# EAGLE design preamp (EAGLE 7.5.0)
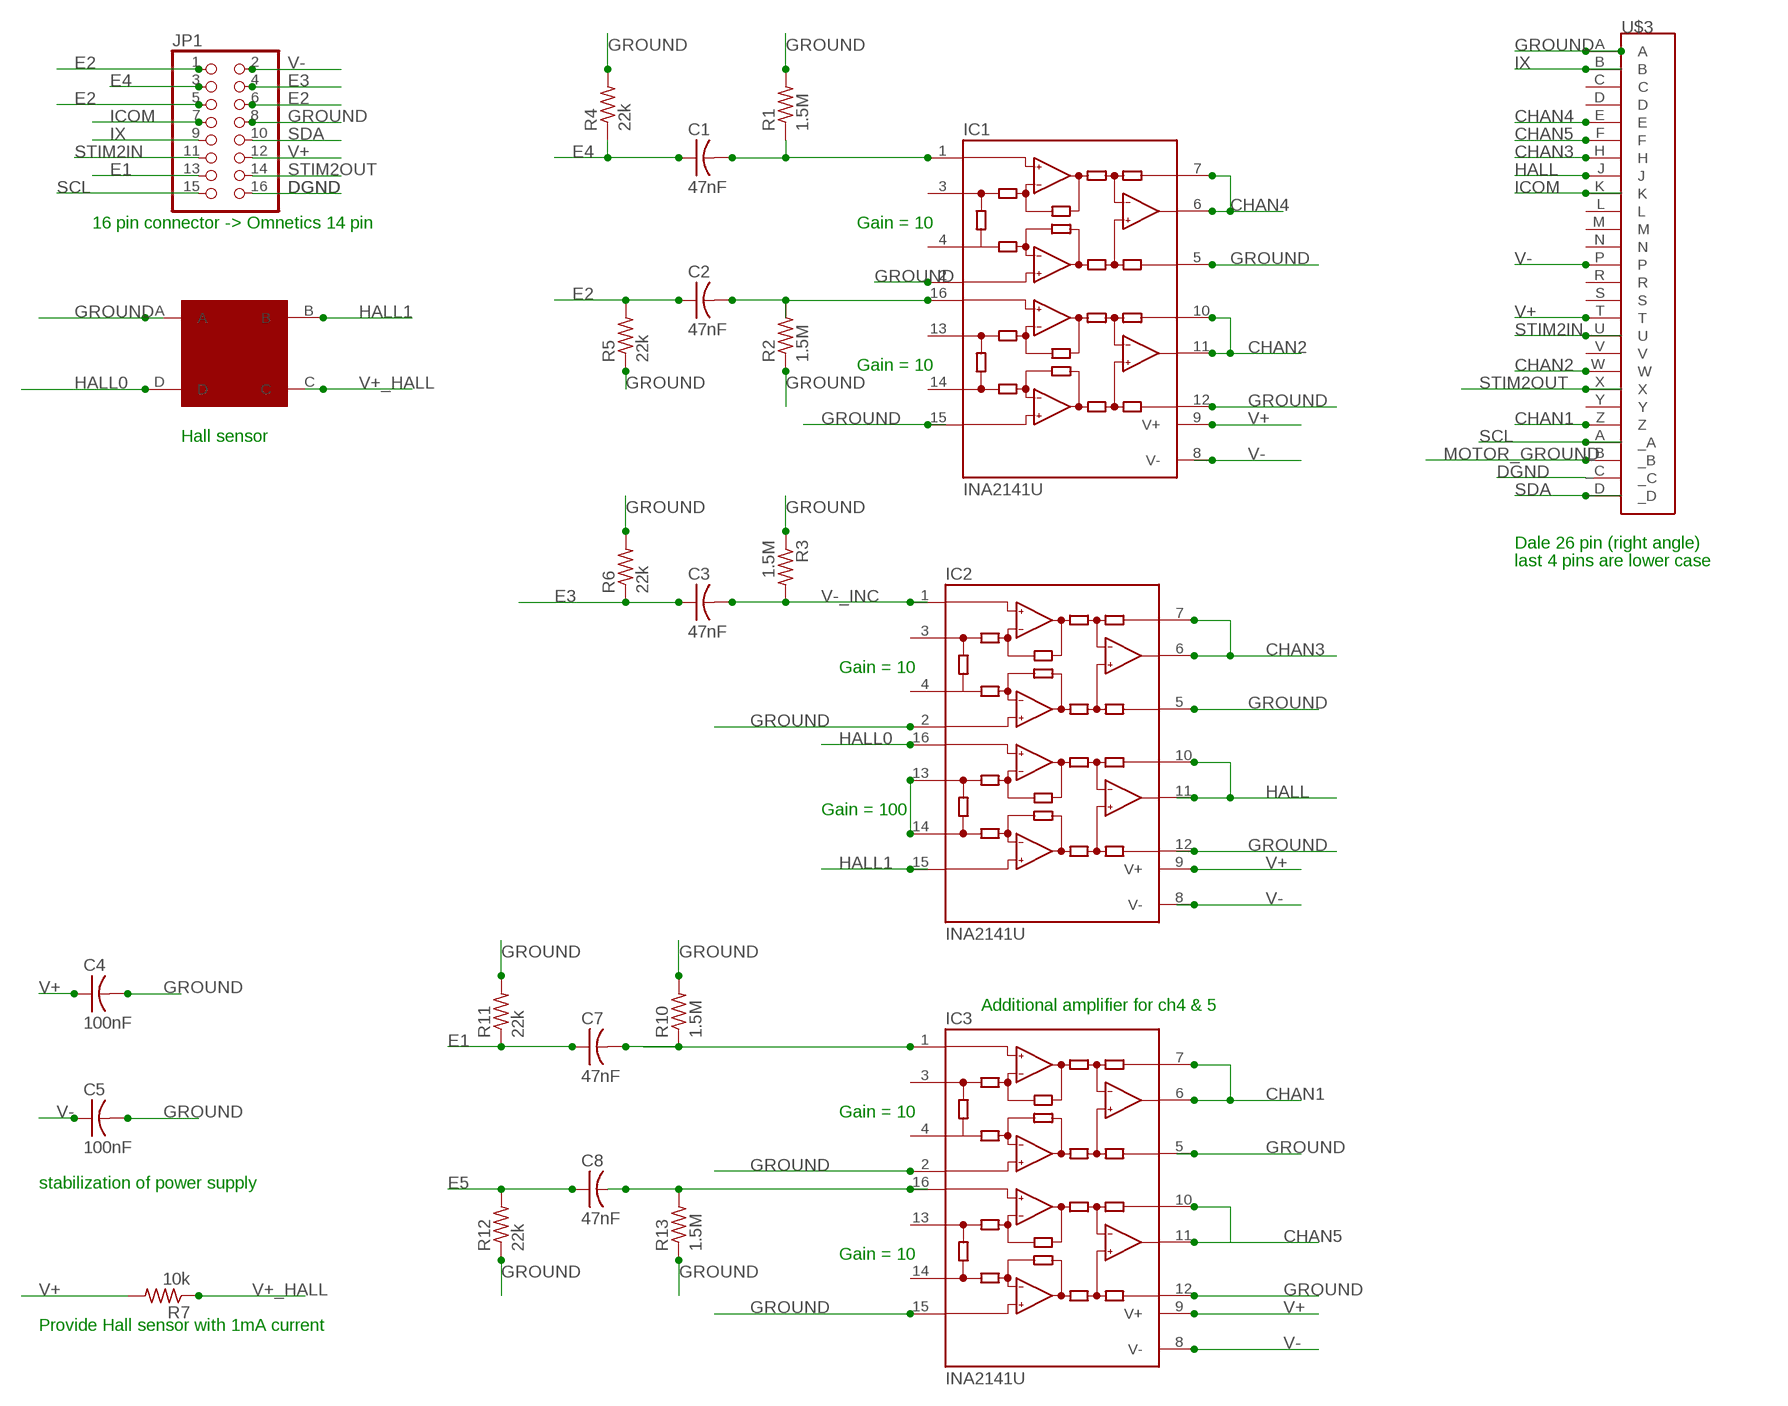
[diagram p0: schematic, sheet 1]

## Parts
C1  47nF  C0805ELM  [R0805ELM]
C2  47nF  C0805ELM  [R0805ELM]
C3  47nF  C0805ELM  [R0805ELM]
C4  100nF  C0805ELM  [R0805ELM]
C5  100nF  C0805ELM  [R0805ELM]
C7  47nF  C0805ELM  [R0805ELM]
C8  47nF  C0805ELM  [R0805ELM]
IC1  INA2141U  [SO16-1]
IC2  INA2141U  [SO16-1]
IC3  INA2141U  [SO16-1]
JP1  PINHD-2X8  [2X08]
R1  1.5M  R0805ELM  [R0805ELM]
R2  1.5M  R0805ELM  [R0805ELM]
R3  1.5M  R0805ELM  [R0805ELM]
R4  22k  R0805ELM  [R0805ELM]
R5  22k  R0805ELM  [R0805ELM]
R6  22k  R0805ELM  [R0805ELM]
R7  10k  R0805ELM  [R0805ELM]
R10  1.5M  R0805ELM  [R0805ELM]
R11  22k  R0805ELM  [R0805ELM]
R12  22k  R0805ELM  [R0805ELM]
R13  1.5M  R0805ELM  [R0805ELM]
U$2  HALL  HALL_ON_SIDE  [HALL_ON_SIDE]
U$3  MMD1P22G-26-M101  [MMD1P22G-26-M101]

## Nets
CHAN1: IC3.6(VOA) IC3.7(SENSEA) U$3.Z
CHAN2: IC1.10(SENSEB) IC1.11(VOB) U$3.W
CHAN3: IC2.6(VOA) IC2.7(SENSEA) U$3.H
CHAN4: IC1.6(VOA) IC1.7(SENSEA) U$3.E
CHAN5: IC3.10(SENSEB) IC3.11(VOB) U$3.F
DGND: JP1.16 U$3._C
E1: C7.1 JP1.13 R11.1
E2: C2.1 JP1.1 JP1.5 JP1.6 R5.2
E3: C3.1 JP1.4 R6.1
E4: C1.1 JP1.3 R4.1
E5: C8.1 R12.2
GAIN_HALL: IC2.13(JB) IC2.14(JB)
GROUND: C4.2 C5.2 IC1.2(INA+) IC1.5(REFA) IC1.12(REFB) IC1.15(INB+) IC2.2(INA+) IC2.5(REFA) IC2.12(REFB) IC3.2(INA+) IC3.5(REFA) IC3.12(REFB) IC3.15(INB+) JP1.8 R1.2 R2.1 R3.1 R4.2 R5.1 R6.2 R10.2 R11.2 R12.1 R13.1 U$2.A U$3.A
HALL: IC2.10(SENSEB) IC2.11(VOB) U$3.J
HALL0: IC2.16(INB-) U$2.D
HALL1: IC2.15(INB+) U$2.B
ICOM: JP1.7 U$3.K
IX: JP1.9 U$3.B
MOTOR_GROUND: U$3._B
N$3: C2.2 IC1.16(INB-) R2.2
N$7: C8.2 IC3.16(INB-) R13.2
N$8: C7.2 IC3.1(INA-) R10.1
SCL: JP1.15 U$3._A
SDA: JP1.10 U$3._D
STIM2IN: JP1.11 U$3.U
STIM2OUT: JP1.14 U$3.X
V+: C4.1 IC1.9(V+) IC2.9(V+) IC3.9(V+) JP1.12 R7.2 U$3.T
V+_HALL: R7.1 U$2.C
V-: C5.1 IC1.8(V-) IC2.8(V-) IC3.8(V-) JP1.2 U$3.P
V-_INA: C1.2 IC1.1(INA-) R1.1
V-_INC: C3.2 IC2.1(INA-) R3.2
Unconnected: IC1.3(JA) IC1.4(JA) IC1.13(JB) IC1.14(JB) IC2.3(JA) IC2.4(JA) IC3.3(JA) IC3.4(JA) IC3.13(JB) IC3.14(JB) U$3.C U$3.D U$3.L U$3.M U$3.N U$3.R U$3.S U$3.V U$3.Y

## Notes on the sheet
- 16 pin connector -> Omnetics 14 pin | Gain = 10
- Gain = 10
- Hall sensor
- Dale 26 pin (right angle)
- last 4 pins are lower case
- Gain = 10
- Gain = 100
- Additional amplifier for ch4 & 5
- Gain = 10
- stabilization of power supply
- Gain = 10
- Provide Hall sensor with 1mA current

## Library data of the parts
C1-C5 C7 C8 = elm:C0805ELM
IC1-IC3 = burr-brown:INA2141: Instrumentation Amplifier Dual, Low Power, G = 10, 100; MF: TEXAS INSTRUMENT CONNECTORS; MPN: INA2141U; OC_FARNELL: 1459468; OC_NEWARK: 74C9853
JP1 = pinhead:PINHD-2X8: PIN HEADER
R1-R7 R10-R13 = elm:R0805ELM
U$2 = elm:HALL_ON_SIDE
U$3 = elm:MMD1P22G-26-M101

## Board
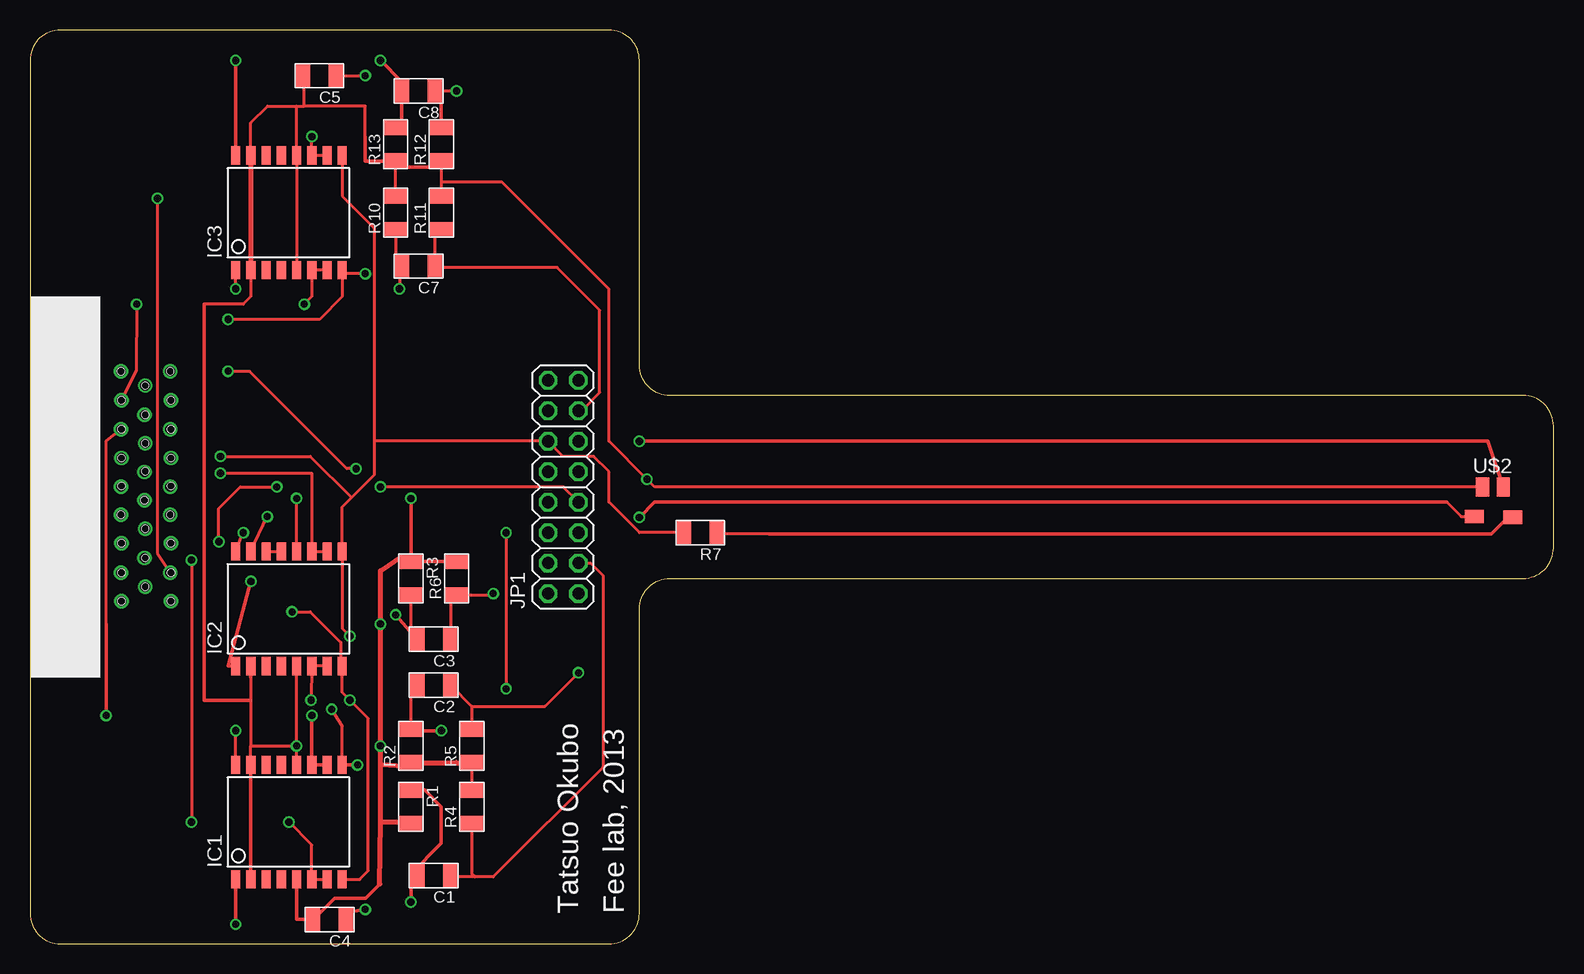
[diagram p1: board, top side]
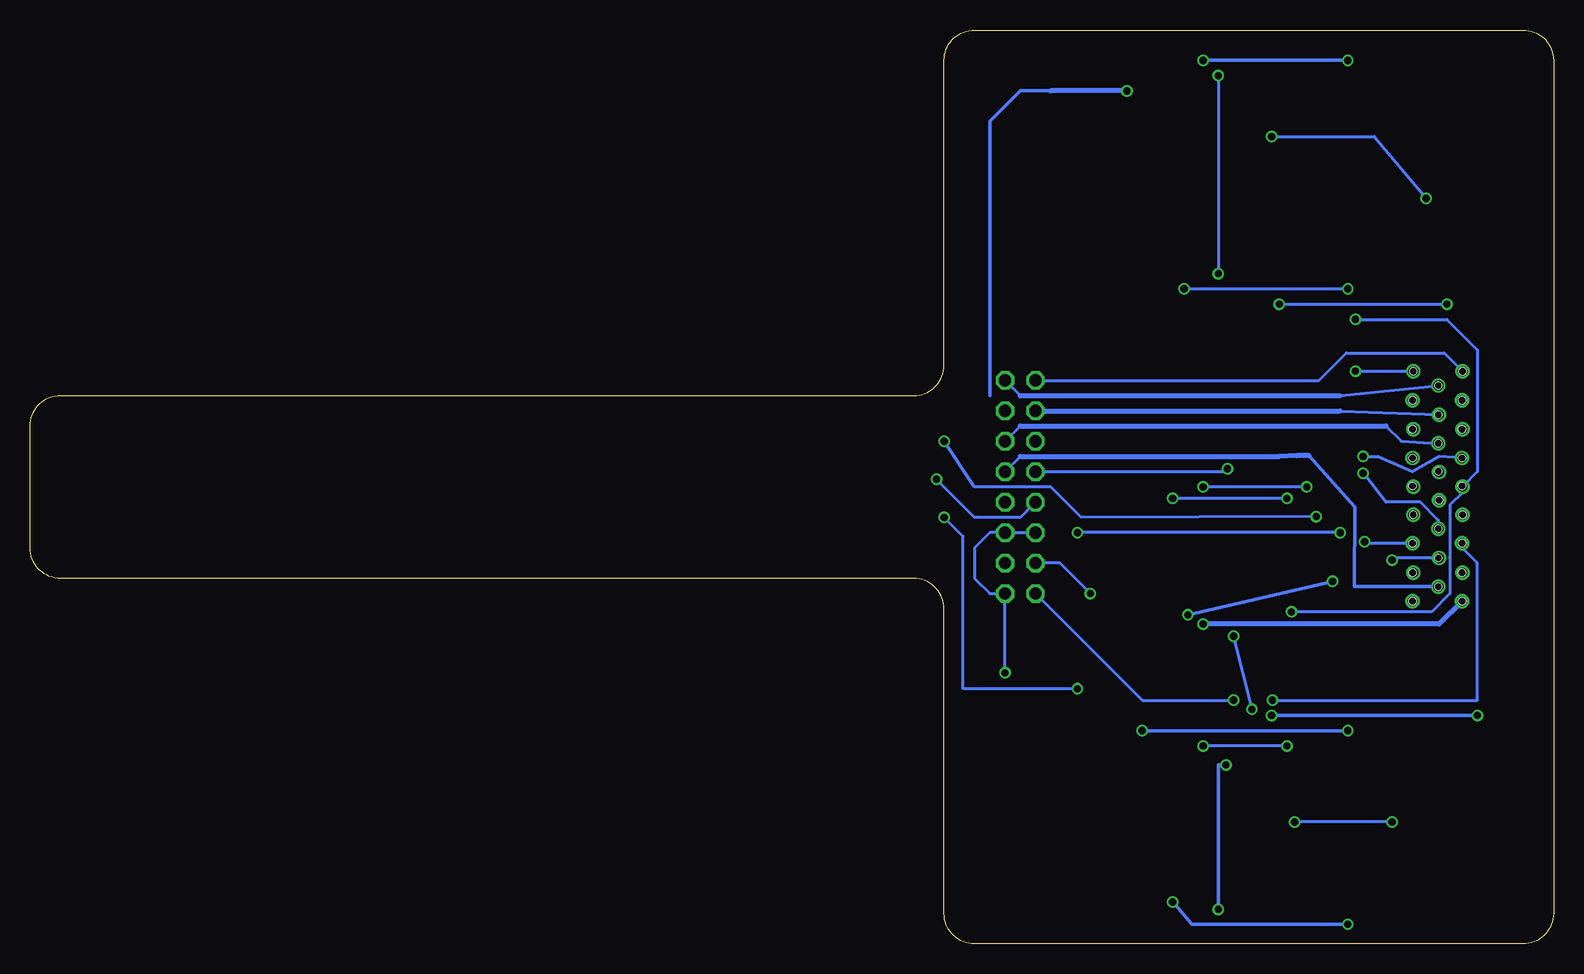
[diagram p2: board, bottom side, seen from below]

Size 127 x 76.2 mm. Coordinates in mm from the lower left corner, seen from the top.
Outline: 0,2.54 arc90 2.54,0 48.26,0 arc90 50.8,2.54 50.8,27.94 arc-90 53.34,30.48 124.46,30.48 arc90 127,33.02 127,43.18 arc90 124.46,45.72 53.34,45.72 arc-90 50.8,48.26 50.8,73.66 arc90 48.26,76.2 2.54,76.2 arc90 0,73.66 0,2.54
Copper layers (1*16): Top 0.0356mm / dielectric 1.5011mm / Bottom 0.0356mm
Design rules "oshpark-2layer": minimum track width 6mil, minimum drill 13mil, track to track 6mil, track to pad 6mil, pad to pad 6mil, via to via 6mil, smd to smd 6mil, copper to edge 15mil, drill to drill 6mil, minimum pad ring 7mil, minimum via ring 7mil, stop-mask expansion 2.5mil, vias tented up to drill 0mil, thermal gap 10mil

### Footprints (pad centres in the part's own frame; a part is rotated, then mirrored left to right if it is on the bottom)
R0805ELM = smd 1.27 x 1.905: 1 -1.397,0; 2 1.397,0
SO16-1 = smd 0.762 x 1.524: 1 -4.445,-4.775; 2 -3.175,-4.775; 3 -1.905,-4.775; 4 -0.635,-4.775; 5 0.635,-4.775; 6 1.905,-4.775; 7 3.175,-4.775; 8 4.445,-4.775; 9 4.445,4.775; 10 3.175,4.775; 11 1.905,4.775; 12 0.635,4.775; 13 -0.635,4.775; 14 -1.905,4.775; 15 -3.175,4.775; 16 -4.445,4.775
2X08 = drill 1.016 octagon: 1 -8.89,-1.27; 2 -8.89,1.27; 3 -6.35,-1.27; 4 -6.35,1.27; 5 -3.81,-1.27; 6 -3.81,1.27; 7 -1.27,-1.27; 8 -1.27,1.27; 9 1.27,-1.27; 10 1.27,1.27; 11 3.81,-1.27; 12 3.81,1.27; 13 6.35,-1.27; 14 6.35,1.27; 15 8.89,-1.27; 16 8.89,1.27
HALL_ON_SIDE = smd 1.118 x 1.6: A -0.838,0; B 0.889,0 | smd 1.6 x 1.118: C 1.676,-2.515; D -1.524,-2.464
MMD1P22G-26-M101 = drill 0.8: _A 1.981,17.983; _B 4.115,16.764; _C -0.051,19.152; _D 4.064,19.152; A 0,0; B 1.981,1.219; C 4.115,0; D -0.051,2.388; E 1.93,3.607; F 4.064,2.388; H 0,4.826; J 1.981,6.045; K 4.115,4.826; L -0.051,7.214; M 1.93,8.433; N 4.064,7.214; P -0.051,9.55; R 1.93,10.77; S 4.064,9.55; T 0,11.938; U 1.981,13.157; V 4.115,11.938; W -0.051,14.326; X 1.93,15.545; Y 4.064,14.326; Z 0,16.764 | hole 0.6: 0,0; 0,2.388; 0,4.826; -0.051,7.214; 0,9.601; 0,11.938; 0,14.326; 0,16.764; -0.051,19.152; 4.115,0; 4.115,2.388; 4.115,4.826; 4.064,7.214; 4.115,9.601; 4.115,11.938; 4.115,14.326; 4.115,16.764; 4.064,19.152; 1.981,1.219; 1.981,3.607; 1.981,6.045; 1.93,8.433; 1.981,10.82; 1.981,13.157; 1.981,15.545; 1.981,17.983

### Placement (x,y rotation side)
C1  33.66,5.71 180 top
C2  33.66,21.59 180 top
C3  33.66,25.4 180 top
C4  24.97,2.05 180 top
C5  24.13,72.39 180 top
C7  32.38,56.52 180 top
C8  32.38,71.12 180 top
IC1  21.59,10.16 0 top
IC2  21.59,27.94 0 top
IC3  21.59,60.96 0 top
JP1  44.45,38.1 90 top
R1  31.75,11.43 270 top
R2  31.75,16.51 90 top
R3  31.75,30.48 270 top
R4  36.83,11.43 90 top
R5  36.83,16.51 90 top
R6  35.56,30.48 90 top
R7  55.88,34.29 180 top
R10  30.48,60.96 90 top
R11  34.29,60.96 90 top
R12  34.29,66.67 90 top
R13  30.48,66.67 90 top
U$2  121.92,38.1 0 top
U$3  7.62,28.57 0 top

### Tracks (layer width: path | path; a pad name or v marks a point on that pad's centre or on a via)
CHAN1  (via drill 0.6)
  Top 0.254: IC3.7 IC3.6 23.5,53.98 v22.86,53.34 | v8.89,53.34 8.87,47.8 U$3.Z
  Bottom 0.254: v22.86,53.34 v8.89,53.34
CHAN2  (via drill 0.6)
  Top 0.254: 6.35,26.67 6.35,41.91 U$3.W
  Top 0.305: IC1.10 IC1.11 v23.5,19.05 | v6.35,19.05 6.35,26.67
  Bottom 0.305: v23.5,19.05 v6.35,19.05
CHAN3  (via drill 0.6)
  Top 0.254: IC2.7 IC2.6 v23.43,20.32
  Bottom 0.254: v23.43,20.32 6.35,20.32 6.35,31.75 7.62,33.02 U$3.H
CHAN4  (via drill 0.6)
  Top 0.254: IC1.7 IC1.6 23.5,8.26 v21.59,10.16 | v13.46,32 v13.46,10.16
  Bottom 0.254: U$3.E 13.28,32.18 v13.46,32 | v13.46,10.16 v21.59,10.16
CHAN5  (via drill 0.6)
  Top 0.254: IC3.10 IC3.11 v23.5,67.31 | v10.62,62.17 10.62,32.62 U$3.F
  Bottom 0.254: v23.5,67.31 14.92,67.31 v10.62,62.17
DGND
  Bottom 0.254: JP1.16 19.56,46.99 17.27,49.28 9.12,49.28 U$3._C
E1
  Top 0.254: JP1.13 45.97,44.45 47.5,45.97 47.5,52.83 43.94,56.39 33.91,56.39 C7.1 33.78,59.05 R11.1
E2  (via drill 0.6)
  Top 0.254: 36.83,17.78 R5.2 36.83,19.81 | C2.1 36.83,19.81 | 36.83,19.81 42.93,19.81 v45.72,22.61
  Bottom 0.254: v45.72,22.61 JP1.1 46.99,29.21 48.26,30.48 48.26,33.02 46.99,34.29 JP1.5 JP1.6
E3  (via drill 0.6)
  Top 0.254: C3.1 35.05,28.57 R6.1 38.48,29.08 v38.61,29.21
  Bottom 0.254: v38.61,29.21 41.15,31.75 JP1.4
E4
  Top 0.254: JP1.3 46.74,31.75 47.75,30.73 47.75,14.73 38.61,5.59 37.08,5.59 | 37.08,5.59 35.18,5.59 C1.1 | R4.1 36.83,5.84 37.08,5.59
E5  (via drill 0.61)
  Top 0.254: 34.29,71.12 v35.56,71.12
  Top 0.305: R12.2 34.29,71.12 C8.1
  Bottom 0.305: 41.91,71.12 44.45,71.12 46.99,68.58 46.99,45.72
  Bottom 0.406: v35.56,71.12 41.91,71.12
GAIN_HALL
  Top 0.254: IC2.14 IC2.13
GROUND  (via drill 0.6)
  Top 0.254: R4.2 R5.1 35.56,15.24 | 31.75,10.16 R1.2 | R12.1 34.29,63.5 | 34.29,63.5 R11.2 | 22.86,69.85 22.86,72.39 C5.2 | 22.86,69.85 27.94,69.85 27.94,67.31 27.94,66.04 | R10.2 30.48,64.77 R13.1 | 31.11,32.38 31.75,31.75 R3.1 | v22.23,16.51 IC2.5 | 22.23,69.85 IC3.12 IC3.5 | 22.23,69.85 22.86,69.85 | IC2.12 v22.23,37.15 | IC1.12 v22.23,16.51 | IC3.2 18.41,53.98 17.78,53.34 14.54,53.34 | IC1.15 18.41,16.51 | 18.41,16.51 v22.23,16.51 | 18.41,16.51 18.41,20.32 18.41,22.23 | U$2.A 52.07,38.1 v51.44,38.73 48.26,41.91 48.26,54.61 39.37,63.5 34.29,63.5 | IC3.15 18.41,68.45 19.81,69.85 22.23,69.85
  Top 0.305: R13.1 27.94,65.28 27.94,67.31 | R3.1 R6.2 | 31.11,32.38 31.75,32.38 v31.75,37.15 | R12.1 33.78,64.77 30.48,64.77 | 29.16,4.97 28,3.81 25.4,3.81 23.52,1.93 C4.2 22.23,2.07 IC1.5 | IC1.2 IC1.15 | IC2.2 18.41,22.23 | 14.54,53.34 14.54,20.32 18.41,20.32
  Top 0.406: 29.21,10.16 29.21,14.92 | 29.21,14.92 v29.21,16.51 v29.21,26.67 29.21,31.11 31.11,32.38 | 29.21,10.16 31.75,10.16 | 29.21,14.92 31.24,14.8 R2.1 R5.1 | 29.16,4.97 29.21,10.16 | IC3.15 IC3.2
  Bottom 0.254: v22.23,37.15 v31.75,37.15 | v22.23,16.51 v29.21,16.51 | JP1.8 44.45,35.56 48.26,35.56 v51.44,38.73
  Bottom 0.406: U$3.A 9.53,26.67 v29.21,26.67
HALL  (via drill 0.6)
  Top 0.254: v15.88,39.24 23.5,39.24 IC2.11 IC2.10
  Bottom 0.254: U$3.J 9.6,35.32 11.11,36.83 13.97,36.83 v15.88,39.24
HALL0  (via drill 0.6)
  Top 0.254: IC2.16 v17.78,34.29 | v39.69,34.29 v39.69,21.27 | 118.11,36.83 119.3,35.64 U$2.D
  Top 0.305: v50.8,35.56 52.07,36.83 118.11,36.83
  Bottom 0.254: v17.78,34.29 v39.69,34.29 | v39.69,21.27 49.21,21.27 49.21,33.97 v50.8,35.56
HALL1  (via drill 0.6)
  Top 0.254: IC2.15 v19.77,35.63
  Top 0.305: v50.8,41.91 121.54,41.91 U$2.B
  Bottom 0.254: v19.77,35.63 39.37,35.56 41.91,38.1 48.26,38.1 v50.8,41.91
ICOM  (via drill 0.6)
  Top 0.254: JP1.7 44.45,38.1 v29.21,38.1 | v15.75,33.53 15.75,36.32 17.53,38.1 v20.57,38.1
  Bottom 0.254: U$3.K 15.62,33.4 v15.75,33.53 | v20.57,38.1 v29.21,38.1
IX
  Bottom 0.254: JP1.9 44.45,40.64
  Bottom 0.305: 20.38,40.7 16.57,36.45 16.59,29.79 U$3.B
  Bottom 0.406: 44.45,40.64 22.86,40.64 21.4,40.7 20.38,40.7
N$3  (via drill 0.6)
  Top 0.254: IC1.16 v17.14,17.78 | R2.2 31.75,21.08 C2.2
  Top 0.305: R2.2 31.88,17.78 v34.29,17.78
  Bottom 0.305: v34.29,17.78 v17.14,17.78
N$7  (via drill 0.6)
  Top 0.305: v17.14,73.66 IC3.16 | R13.2 30.99,68.07 C8.2 30.99,71.88 v29.21,73.66
  Bottom 0.305: v29.21,73.66 v17.14,73.66
N$8  (via drill 0.6)
  Top 0.254: R10.1 30.48,57.15 C7.2 30.99,57.15 v30.8,54.61 | v17.14,54.61 IC3.1
  Bottom 0.254: v17.14,54.61 v30.8,54.61
SCL
  Bottom 0.254: 17.78,45.72 U$3._A | 44.45,45.72 JP1.15
  Bottom 0.406: 44.45,45.72 17.78,45.72
SDA  (via drill 0.6)
  Top 0.254: v27.18,39.62 26.42,39.62 18.31,47.73 16.54,47.73 v16.51,47.75
  Bottom 0.254: JP1.10 27.43,39.37 v27.18,39.62 | v16.51,47.75 11.71,47.75 U$3._D
STIM2IN
  Bottom 0.254: JP1.11 44.45,43.18 | 13.97,43.18 12.7,41.91 U$3.U
  Bottom 0.406: 44.45,43.18 13.97,43.18
STIM2OUT
  Bottom 0.254: 17.78,44.45 U$3.X
  Bottom 0.406: JP1.14 17.78,44.45
V+  (via drill 0.6)
  Top 0.254: 28.7,41.91 JP1.12 44.45,40.64 46.99,40.64 48.26,39.37 48.26,36.83 50.8,34.29 R7.2 | 28.7,41.91 28.7,39.12 26.8,37.21 | IC1.9 26.04,18.16 v25.15,19.56 | v26.67,25.65 26.04,26.29 IC2.9 26.04,36.45 26.8,37.21 | IC3.9 26.04,62.36 28.7,59.69 28.7,41.91 | v15.88,40.64 23.37,40.64 26.8,37.21
  Top 0.305: C4.1 26.8,2.67 v27.94,2.88 | v27.3,14.92 IC1.9
  Bottom 0.254: U$3.T 9.53,40.64 11.75,39.37 14.61,40.64 v15.88,40.64 | v26.67,25.65 v25.15,19.56
  Bottom 0.305: v27.94,2.88 27.94,14.92 v27.3,14.92
V+_HALL
  Top 0.254: 61.59,34.16 57.4,34.16 R7.1
  Top 0.305: 61.59,34.16 121.79,34.16 123.19,35.56 123.57,35.56 U$2.C
V-  (via drill 0.6)
  Top 0.254: C5.1 v27.94,72.39 | v16.51,52.07 24.13,52.07 26.04,53.98 IC3.8 26.04,55.88 v27.94,55.88 | IC1.8 27.48,5.38 28.19,6.1 28.19,18.8 v26.67,20.32 26.04,20.95 IC2.8 25.91,23.29 25.91,25.15 23.37,27.69 v21.84,27.69
  Bottom 0.254: v27.94,72.39 v27.94,55.88 | v16.51,52.07 8.89,52.07 6.35,49.53 6.35,39.37 7.57,38.15 U$3.P 7.57,37.64 8.64,36.58 8.64,29.21 10.16,27.69 v21.84,27.69 | JP1.2 34.29,20.32 v26.67,20.32
V-_INA  (via drill 0.6)
  Top 0.305: IC1.1 v17.14,1.64 | v31.75,3.49 31.75,5.84 | 31.75,5.84 C1.2 | 31.75,5.84 34.29,8.38 34.29,11.43 32.89,12.83 R1.1
  Bottom 0.305: v17.14,1.64 30.16,1.64 v31.75,3.49
V-_INC  (via drill 0.6)
  Top 0.254: 31.75,29.21 R3.2 31.75,25.4 C3.2
  Top 0.305: IC2.1 16.51,23.16 v18.41,30.23 | v30.48,27.43 C3.2
  Bottom 0.305: v18.41,30.23 v30.48,27.43

### Text on the board
tPlace: Tatsuo Okubo | Fee lab, 2013